# EasyEDA Pro project mt3608.eprj

# Schematic MT3608
Create Date: 2024-01-10; Page Name: P1; Project Name: mt3608; Schematic Name: MT3608; Update Date: 2024-01-10; Company: 嘉立创EDA; Page Size: A4; Version: V1.0
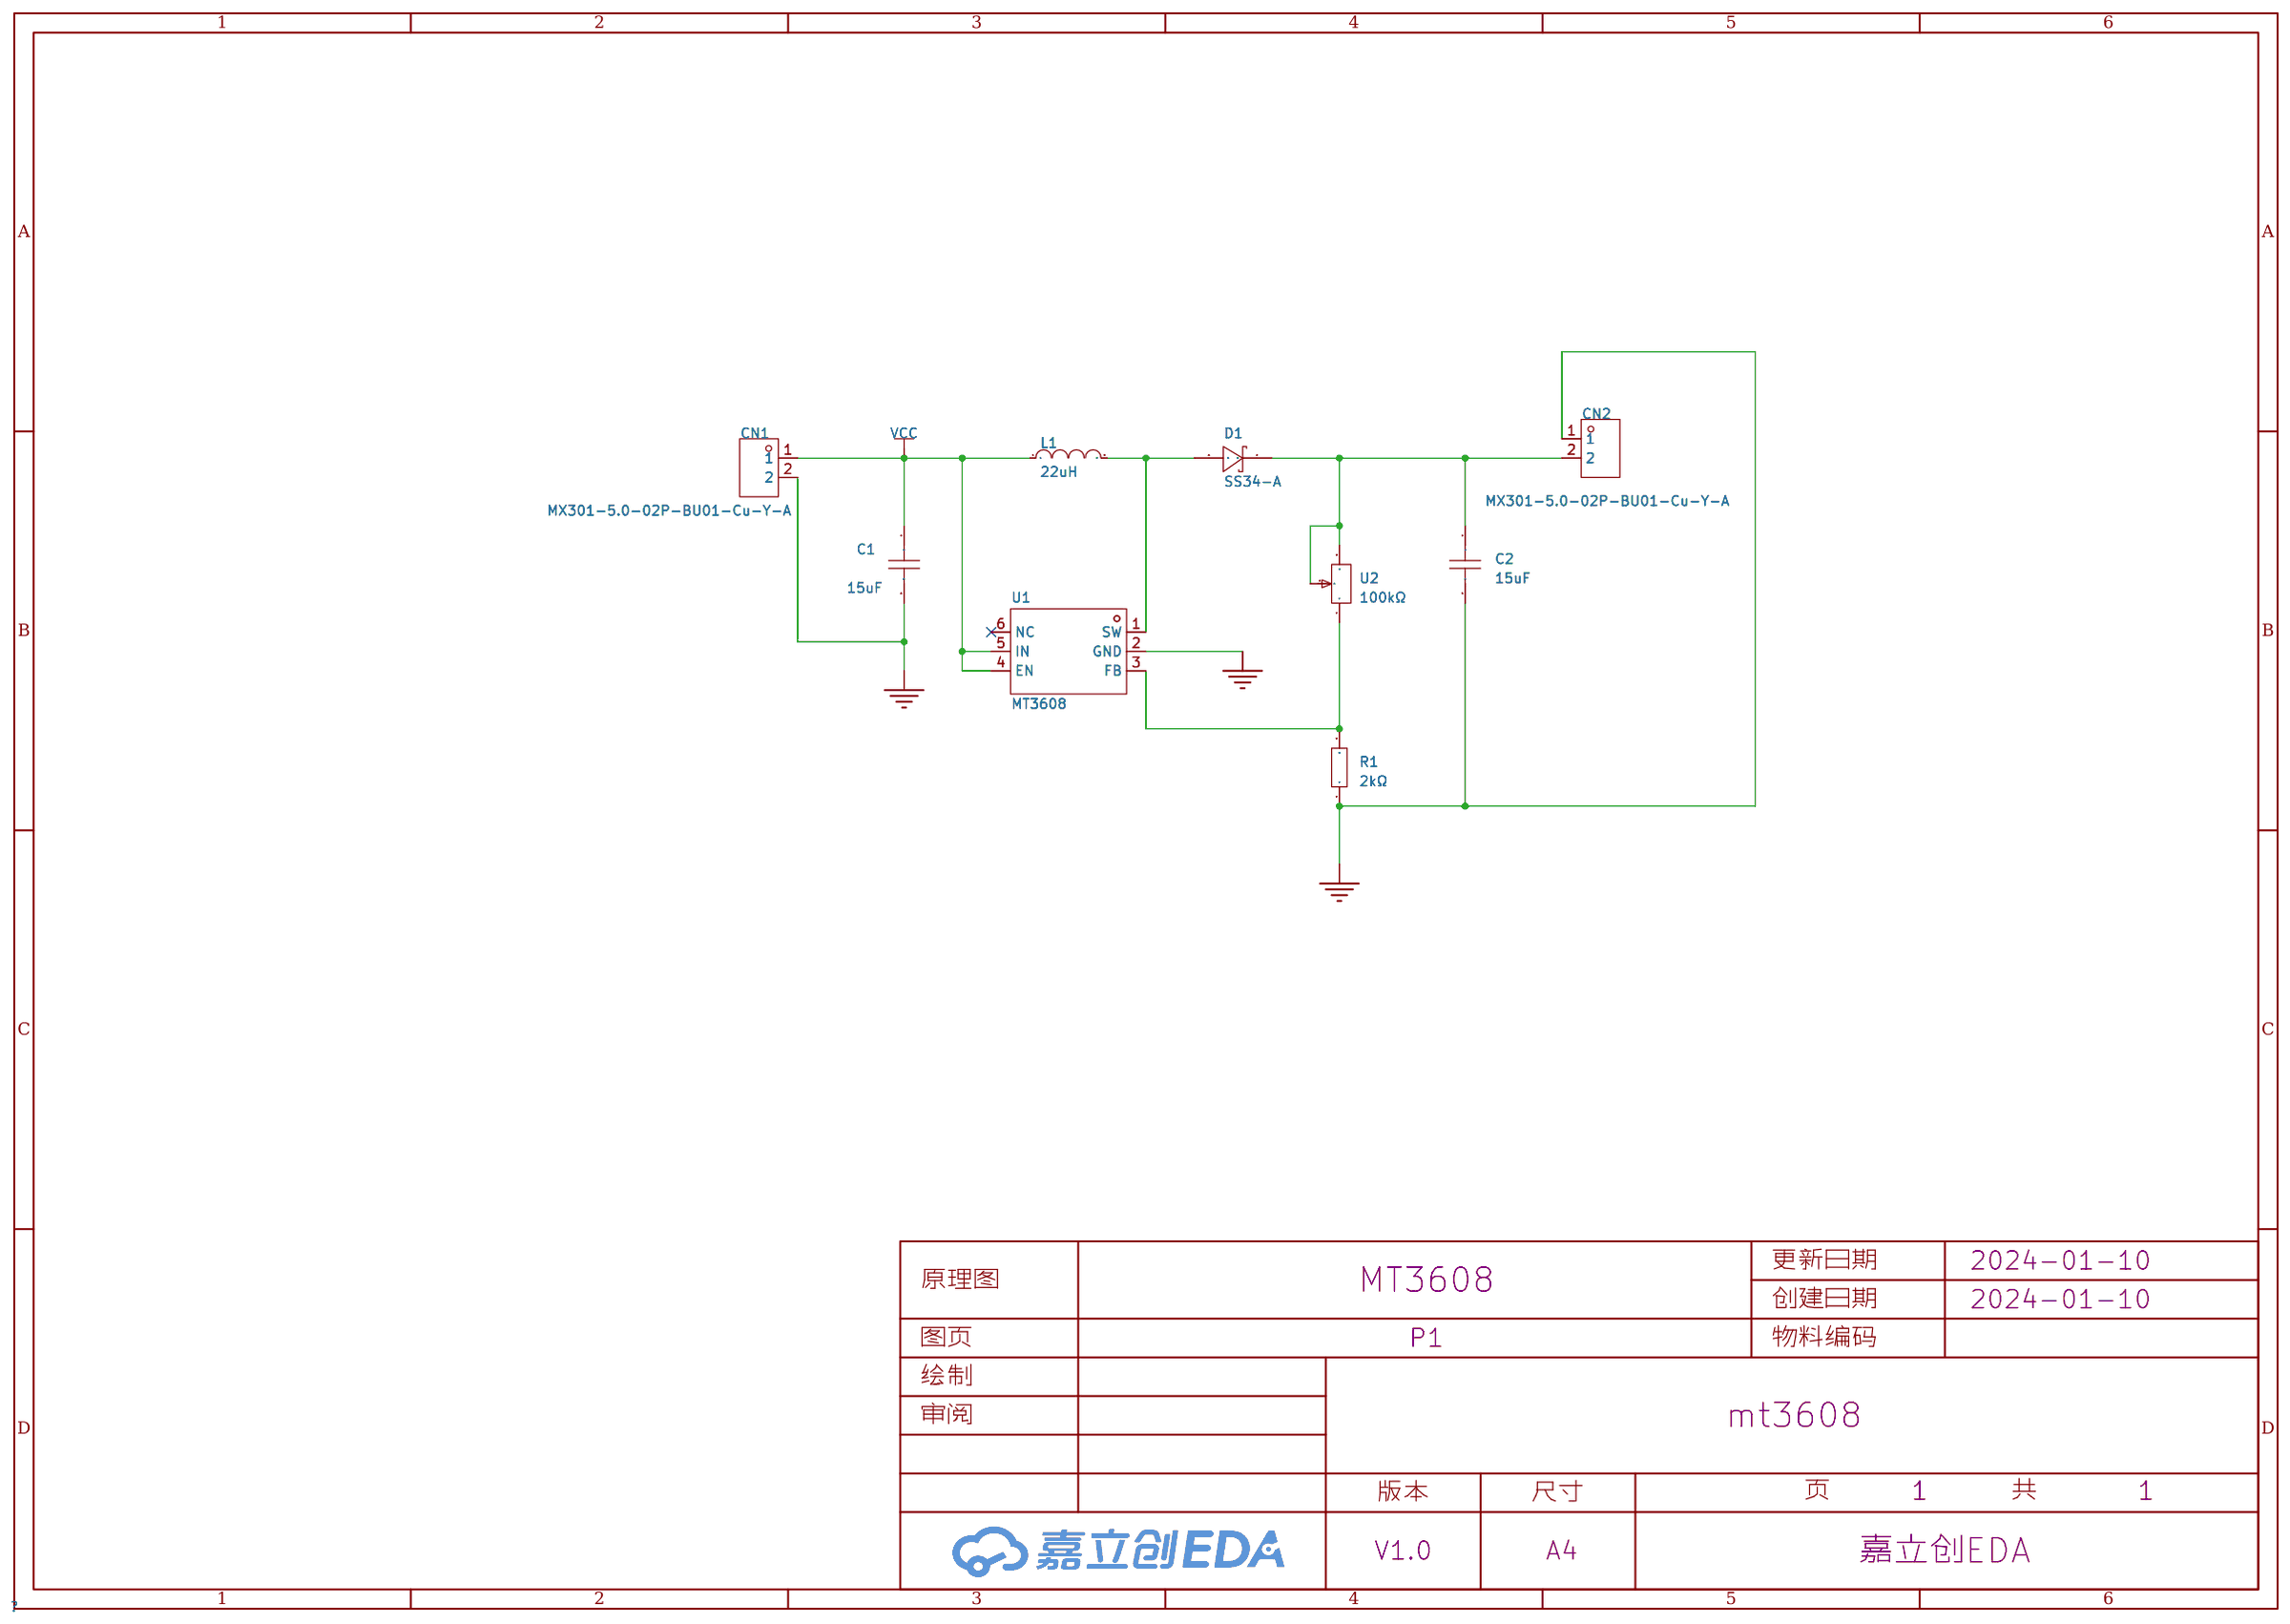
[diagram p0: schematic sheet]

## Parts
C1  15uF  [C0603]
C2  15uF  [C0603]
CN1  MX301-5.0-02P-BU01-Cu-Y-A  [CONN-TH_2P-P5.0-MX301-5.0-02P-BU01-CU-Y-A]
CN2  MX301-5.0-02P-BU01-Cu-Y-A  [CONN-TH_2P-P5.0-MX301-5.0-02P-BU01-CU-Y-A]
D1  SS34-A  [SMA_L4.3-W2.6-LS5.2-RD]
L1  22uH  [IND-SMD_L10.5-W10.5]
R1  2kΩ  [R0603]
U1  MT3608  [SOT-23-6_L2.9-W1.6-P0.95-LS2.8-BL]
U2  100kΩ  [RES-ADJ-SMD_RM065-V1]

## Library data of the parts
C1 C2 = C1608X5R0J156MT000E: 容值:15uF;精度:±20%;额定电压:6.3V;材质(温度系数):X5R;; LCSC Part Name: 15uF ±20% 6.3V; Supplier Part: C445715; Manufacturer: TDK; Supplier Footprint: 0603; JLCPCB Part Class: 扩展库; Datasheet: https://atta.szlcsc.com/upload/public/pdf/source/20191108/C445765_930F403C9F9F1C91FA65B6959DB97EFA.pdf; Supplier: LCSC; Tolerance: ±20%; Voltage Rated: 6.3V; Temperature Coefficient: X5R
CN1 CN2 = MX301-5.0-02P-BU01-Cu-Y-A: 结构:1x2P;间距:5mm;颜色:蓝色;安装方式:直插;额定电流:16A;额定电压:300V;排数:1;线规 - AWG:14~24;线规 - 平方毫米:1.5;每排PIN数:2;触头材质:铜合金;触头镀层:锡;工作温度范围:-40℃~+105℃;; LCSC Part Name: 5mm 1x2P 排数:1 每排P数:2 直插; Supplier Part: C5188422; Manufacturer: MAX(迈旭); Supplier Footprint: 插件,P=5mm; JLCPCB Part Class: Extended Part; Datasheet: https://atta.szlcsc.com/upload/public/pdf/source/20230915/1F0A484E8C4B07E7C9BE20D191F8A304.pdf; Supplier: LCSC; Structure: 1x2P; Pitch: 5mm; Color: 蓝色; Mounting Style: 直插; Current Rating (Max): 16A; Voltage Rating (Max): 300V; Number of Pins: 2P; Number of Rows: 1; Wire Gauge - AWG: 14~24; Wire Gauge - mm2: 1.5; Number of PINs Per Row: 2; Contact Material: 铜合金; Contact Plating: 锡; Operating Temperature Range: -40℃~+105℃
D1 = SS34-A: 正向压降(Vf):550mV@3A;直流反向耐压(Vr):40V;平均整流电流(Io):3A;; LCSC Part Name: 电压:40V 电流:3A; Supplier Part: C143201; Manufacturer: FMS(美丽微); Supplier Footprint: SMA(DO-214AC); JLCPCB Part Class: 扩展库; Datasheet: https://atta.szlcsc.com/upload/public/pdf/source/20171109/C143203_15102201708731103754.pdf; Supplier: LCSC; Forward Voltage (Vf@If): 550mV@3A; Reverse Voltage (Vr): 40V; Average Rectified Current (Io): 3A
L1 = SLD10D40S-220MTT: 电感值:22uH;精度:±20%;额定电流:2.9A;; LCSC Part Name: 22uH ±20%; Supplier Part: C182172; Manufacturer: Sunltech(韩国顺磁); Supplier Footprint: SMD; JLCPCB Part Class: 扩展库; Datasheet: https://atta.szlcsc.com/upload/public/pdf/source/20180516/C216173_9CE92605FA48E61FB30A7708978C0FC3.pdf; Supplier: LCSC; Tolerance: ±20%; Rated Current: 2.9A; DC Resistance (DCR): 73mΩ
R1 = 0603WAF2001T5E: 阻值:2kΩ;精度:±1%;功率:100mW;温度系数:±100ppm/℃;电阻类型:厚膜电阻;; LCSC Part Name: 2kΩ ±1% 100mW 厚膜电阻; Supplier Part: C22975; Manufacturer: UNI-ROYAL(厚声); Supplier Footprint: 0603; JLCPCB Part Class: 基础库; Datasheet: https://atta.szlcsc.com/upload/public/pdf/source/20200306/C422600_1E6D84923E4A46A82E41ADD87F860B5C.pdf; Supplier: LCSC; Tolerance: ±1%; Power(Watts): 100mW; Overload Voltage (Max): 75V; Temperature Coefficient: ±100ppm/℃; Type: 厚膜电阻; Operating Temperature Range: -55℃~+155℃
U1 = MT3608: 功能类型:升压型;输入电压:2V~24V;输出电压:28V;输出电流(最大值):-;; LCSC Part Name: 升压型 输入2V~24V 输出28V; Supplier Part: C84817; Manufacturer: 西安航天民芯; Supplier Footprint: SOT-23-6; JLCPCB Part Class: 扩展库; Datasheet: https://atta.szlcsc.com/upload/public/pdf/source/20161110/1478743351706.pdf; Supplier: LCSC; Function: 升压型; Number of Outputs: 1; Topology: 升压式; Input Voltage: 2V~24V; Output Voltage: 28V; Switching Frequency: 1.2MHz
U2 = RM065-104(100K): 阻值:100kΩ;精度:±25%;功率:100mW;; LCSC Part Name: 100kΩ ±25%; Supplier Part: C5205024; Manufacturer: BOCHEN(博晨); Supplier Footprint: 插件; JLCPCB Part Class: 扩展库; Datasheet: https://atta.szlcsc.com/upload/public/pdf/source/20221019/6263C46FBC7F1B66CBAADA74DC5EFAA2.pdf; Supplier: LCSC; Tolerance: ±25%; Power(Watts): 100mW

## Nets
GND: C1.2 C2.2 CN1.2 CN2.1 R1.1 U1.2(GND)
VCC: C1.1 CN1.1 L1.1 U1.4(EN) U1.5(IN)
$1N519: D1.2(A) L1.2 U1.1(SW)
$1N633: R1.2 U1.3(FB) U2.1
$1N872: C2.1 CN2.2 D1.1(C) U2.2 U2.3

Not connected (* = marked no-connect by the designer): U1 6(NC)*

# Schematic MT3608GUN
Create Date: 2024-01-10; Page Name: P1; Project Name: mt3608; Schematic Name: MT3608GUN; Update Date: 2024-01-10; Company: 嘉立创EDA; Page Size: A4; Version: V1.0
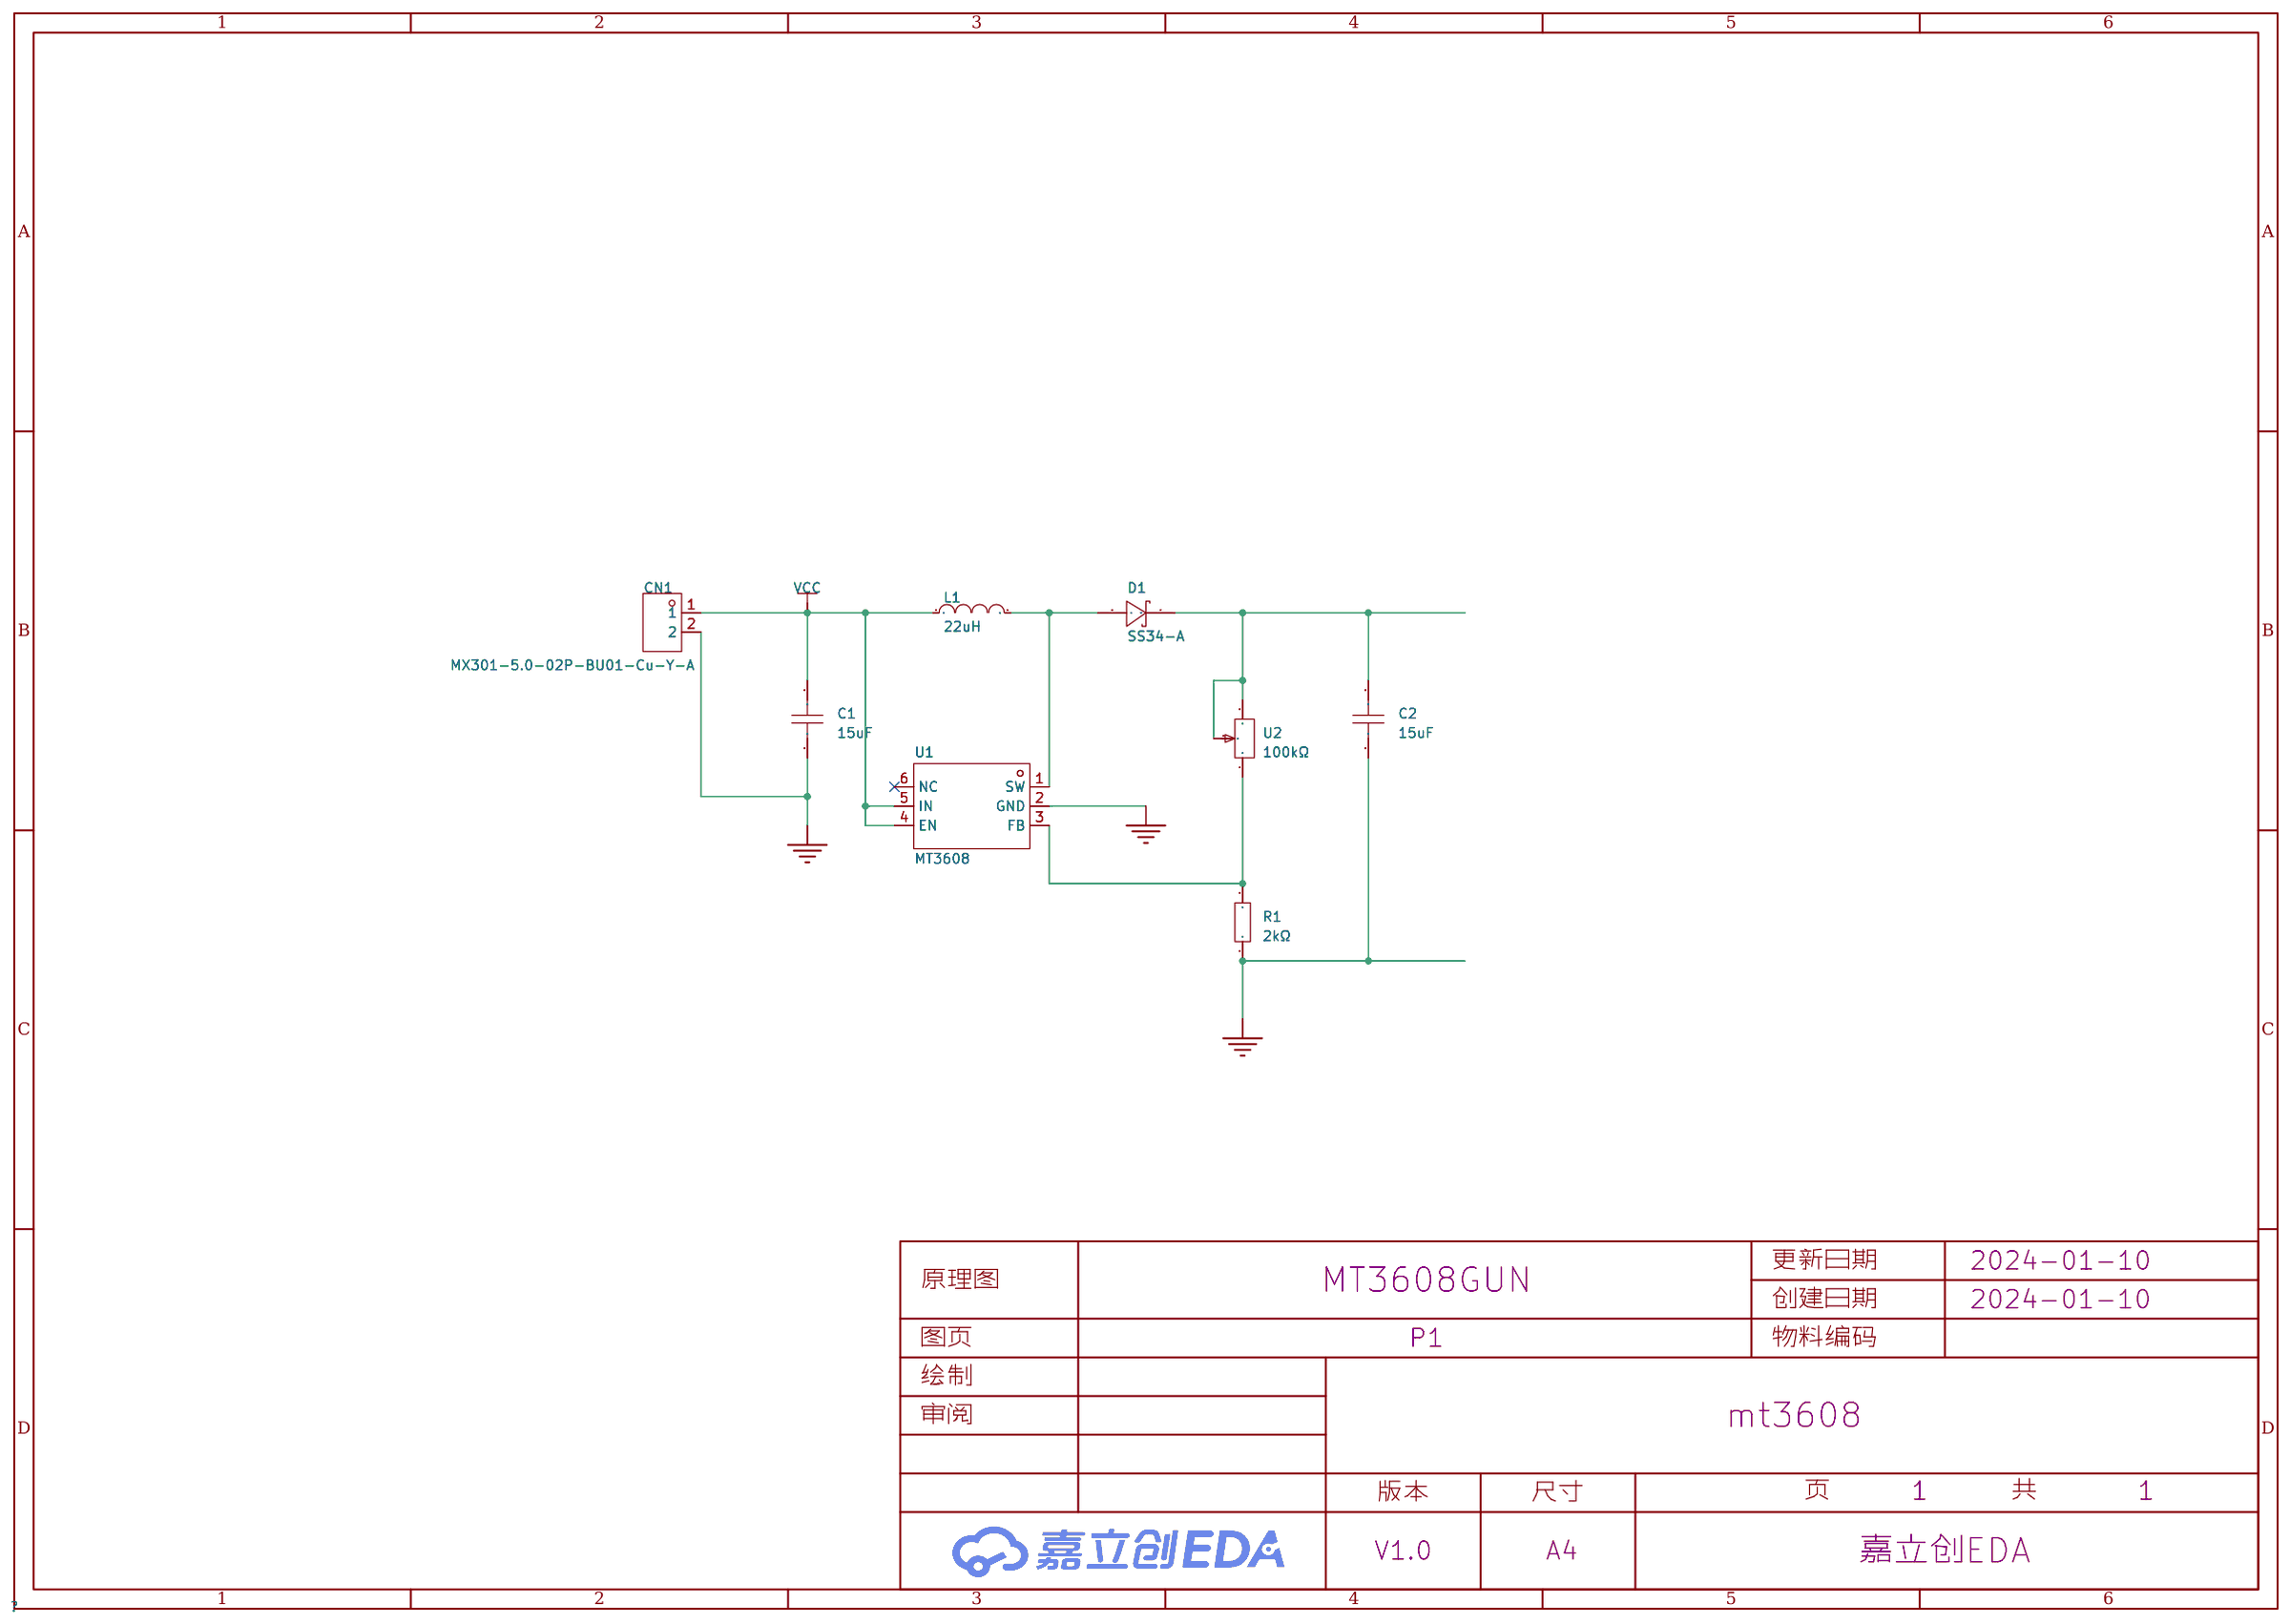
[diagram p1: schematic sheet]

## Parts
C1  15uF  [C0603]
C2  15uF  [C0603]
CN1  MX301-5.0-02P-BU01-Cu-Y-A  [CONN-TH_2P-P5.0-MX301-5.0-02P-BU01-CU-Y-A]
D1  SS34-A  [SMA_L4.3-W2.6-LS5.2-RD]
L1  22uH  [IND-SMD_L10.5-W10.5]
R1  2kΩ  [R0603]
U1  MT3608  [SOT-23-6_L2.9-W1.6-P0.95-LS2.8-BL]
U2  100kΩ  [RES-ADJ-SMD_RM065-V1]

## Library data of the parts
C1 C2 = C1608X5R0J156MT000E: 容值:15uF;精度:±20%;额定电压:6.3V;材质(温度系数):X5R;; LCSC Part Name: 15uF ±20% 6.3V; Supplier Part: C445715; Manufacturer: TDK; Supplier Footprint: 0603; JLCPCB Part Class: 扩展库; Datasheet: https://atta.szlcsc.com/upload/public/pdf/source/20191108/C445765_930F403C9F9F1C91FA65B6959DB97EFA.pdf; Supplier: LCSC; Tolerance: ±20%; Voltage Rated: 6.3V; Temperature Coefficient: X5R
CN1 = MX301-5.0-02P-BU01-Cu-Y-A: 结构:1x2P;间距:5mm;颜色:蓝色;安装方式:直插;额定电流:16A;额定电压:300V;排数:1;线规 - AWG:14~24;线规 - 平方毫米:1.5;每排PIN数:2;触头材质:铜合金;触头镀层:锡;工作温度范围:-40℃~+105℃;; LCSC Part Name: 5mm 1x2P 排数:1 每排P数:2 直插; Supplier Part: C5188422; Manufacturer: MAX(迈旭); Supplier Footprint: 插件,P=5mm; JLCPCB Part Class: Extended Part; Datasheet: https://atta.szlcsc.com/upload/public/pdf/source/20230915/1F0A484E8C4B07E7C9BE20D191F8A304.pdf; Supplier: LCSC; Structure: 1x2P; Pitch: 5mm; Color: 蓝色; Mounting Style: 直插; Current Rating (Max): 16A; Voltage Rating (Max): 300V; Number of Pins: 2P; Number of Rows: 1; Wire Gauge - AWG: 14~24; Wire Gauge - mm2: 1.5; Number of PINs Per Row: 2; Contact Material: 铜合金; Contact Plating: 锡; Operating Temperature Range: -40℃~+105℃
D1 = SS34-A: 正向压降(Vf):550mV@3A;直流反向耐压(Vr):40V;平均整流电流(Io):3A;; LCSC Part Name: 电压:40V 电流:3A; Supplier Part: C143201; Manufacturer: FMS(美丽微); Supplier Footprint: SMA(DO-214AC); JLCPCB Part Class: 扩展库; Datasheet: https://atta.szlcsc.com/upload/public/pdf/source/20171109/C143203_15102201708731103754.pdf; Supplier: LCSC; Forward Voltage (Vf@If): 550mV@3A; Reverse Voltage (Vr): 40V; Average Rectified Current (Io): 3A
L1 = SLD10D40S-220MTT: 电感值:22uH;精度:±20%;额定电流:2.9A;; LCSC Part Name: 22uH ±20%; Supplier Part: C182172; Manufacturer: Sunltech(韩国顺磁); Supplier Footprint: SMD; JLCPCB Part Class: 扩展库; Datasheet: https://atta.szlcsc.com/upload/public/pdf/source/20180516/C216173_9CE92605FA48E61FB30A7708978C0FC3.pdf; Supplier: LCSC; Tolerance: ±20%; Rated Current: 2.9A; DC Resistance (DCR): 73mΩ
R1 = 0603WAF2001T5E: 阻值:2kΩ;精度:±1%;功率:100mW;温度系数:±100ppm/℃;电阻类型:厚膜电阻;; LCSC Part Name: 2kΩ ±1% 100mW 厚膜电阻; Supplier Part: C22975; Manufacturer: UNI-ROYAL(厚声); Supplier Footprint: 0603; JLCPCB Part Class: 基础库; Datasheet: https://atta.szlcsc.com/upload/public/pdf/source/20200306/C422600_1E6D84923E4A46A82E41ADD87F860B5C.pdf; Supplier: LCSC; Tolerance: ±1%; Power(Watts): 100mW; Overload Voltage (Max): 75V; Temperature Coefficient: ±100ppm/℃; Type: 厚膜电阻; Operating Temperature Range: -55℃~+155℃
U1 = MT3608: 功能类型:升压型;输入电压:2V~24V;输出电压:28V;输出电流(最大值):-;; LCSC Part Name: 升压型 输入2V~24V 输出28V; Supplier Part: C84817; Manufacturer: 西安航天民芯; Supplier Footprint: SOT-23-6; JLCPCB Part Class: 扩展库; Datasheet: https://atta.szlcsc.com/upload/public/pdf/source/20161110/1478743351706.pdf; Supplier: LCSC; Function: 升压型; Number of Outputs: 1; Topology: 升压式; Input Voltage: 2V~24V; Output Voltage: 28V; Switching Frequency: 1.2MHz
U2 = RM065-104(100K): 阻值:100kΩ;精度:±25%;功率:100mW;; LCSC Part Name: 100kΩ ±25%; Supplier Part: C5205024; Manufacturer: BOCHEN(博晨); Supplier Footprint: 插件; JLCPCB Part Class: 扩展库; Datasheet: https://atta.szlcsc.com/upload/public/pdf/source/20221019/6263C46FBC7F1B66CBAADA74DC5EFAA2.pdf; Supplier: LCSC; Tolerance: ±25%; Power(Watts): 100mW

## Nets
GND: C1.2 C2.2 CN1.2 R1.1 U1.2(GND)
VCC: C1.1 CN1.1 L1.1 U1.4(EN) U1.5(IN)
$1N430: D1.2(A) L1.2 U1.1(SW)
$1N432: R1.2 U1.3(FB) U2.1
$1N433: C2.1 D1.1(C) U2.2 U2.3

Not connected (* = marked no-connect by the designer): U1 6(NC)*

# Schematic MT3608V2
Create Date: 2024-05-22; Page Name: P1; Project Name: mt3608; Schematic Name: MT3608V2; Update Date: 2024-05-23; Company: 嘉立创EDA; Page Size: A4; Version: V1.0
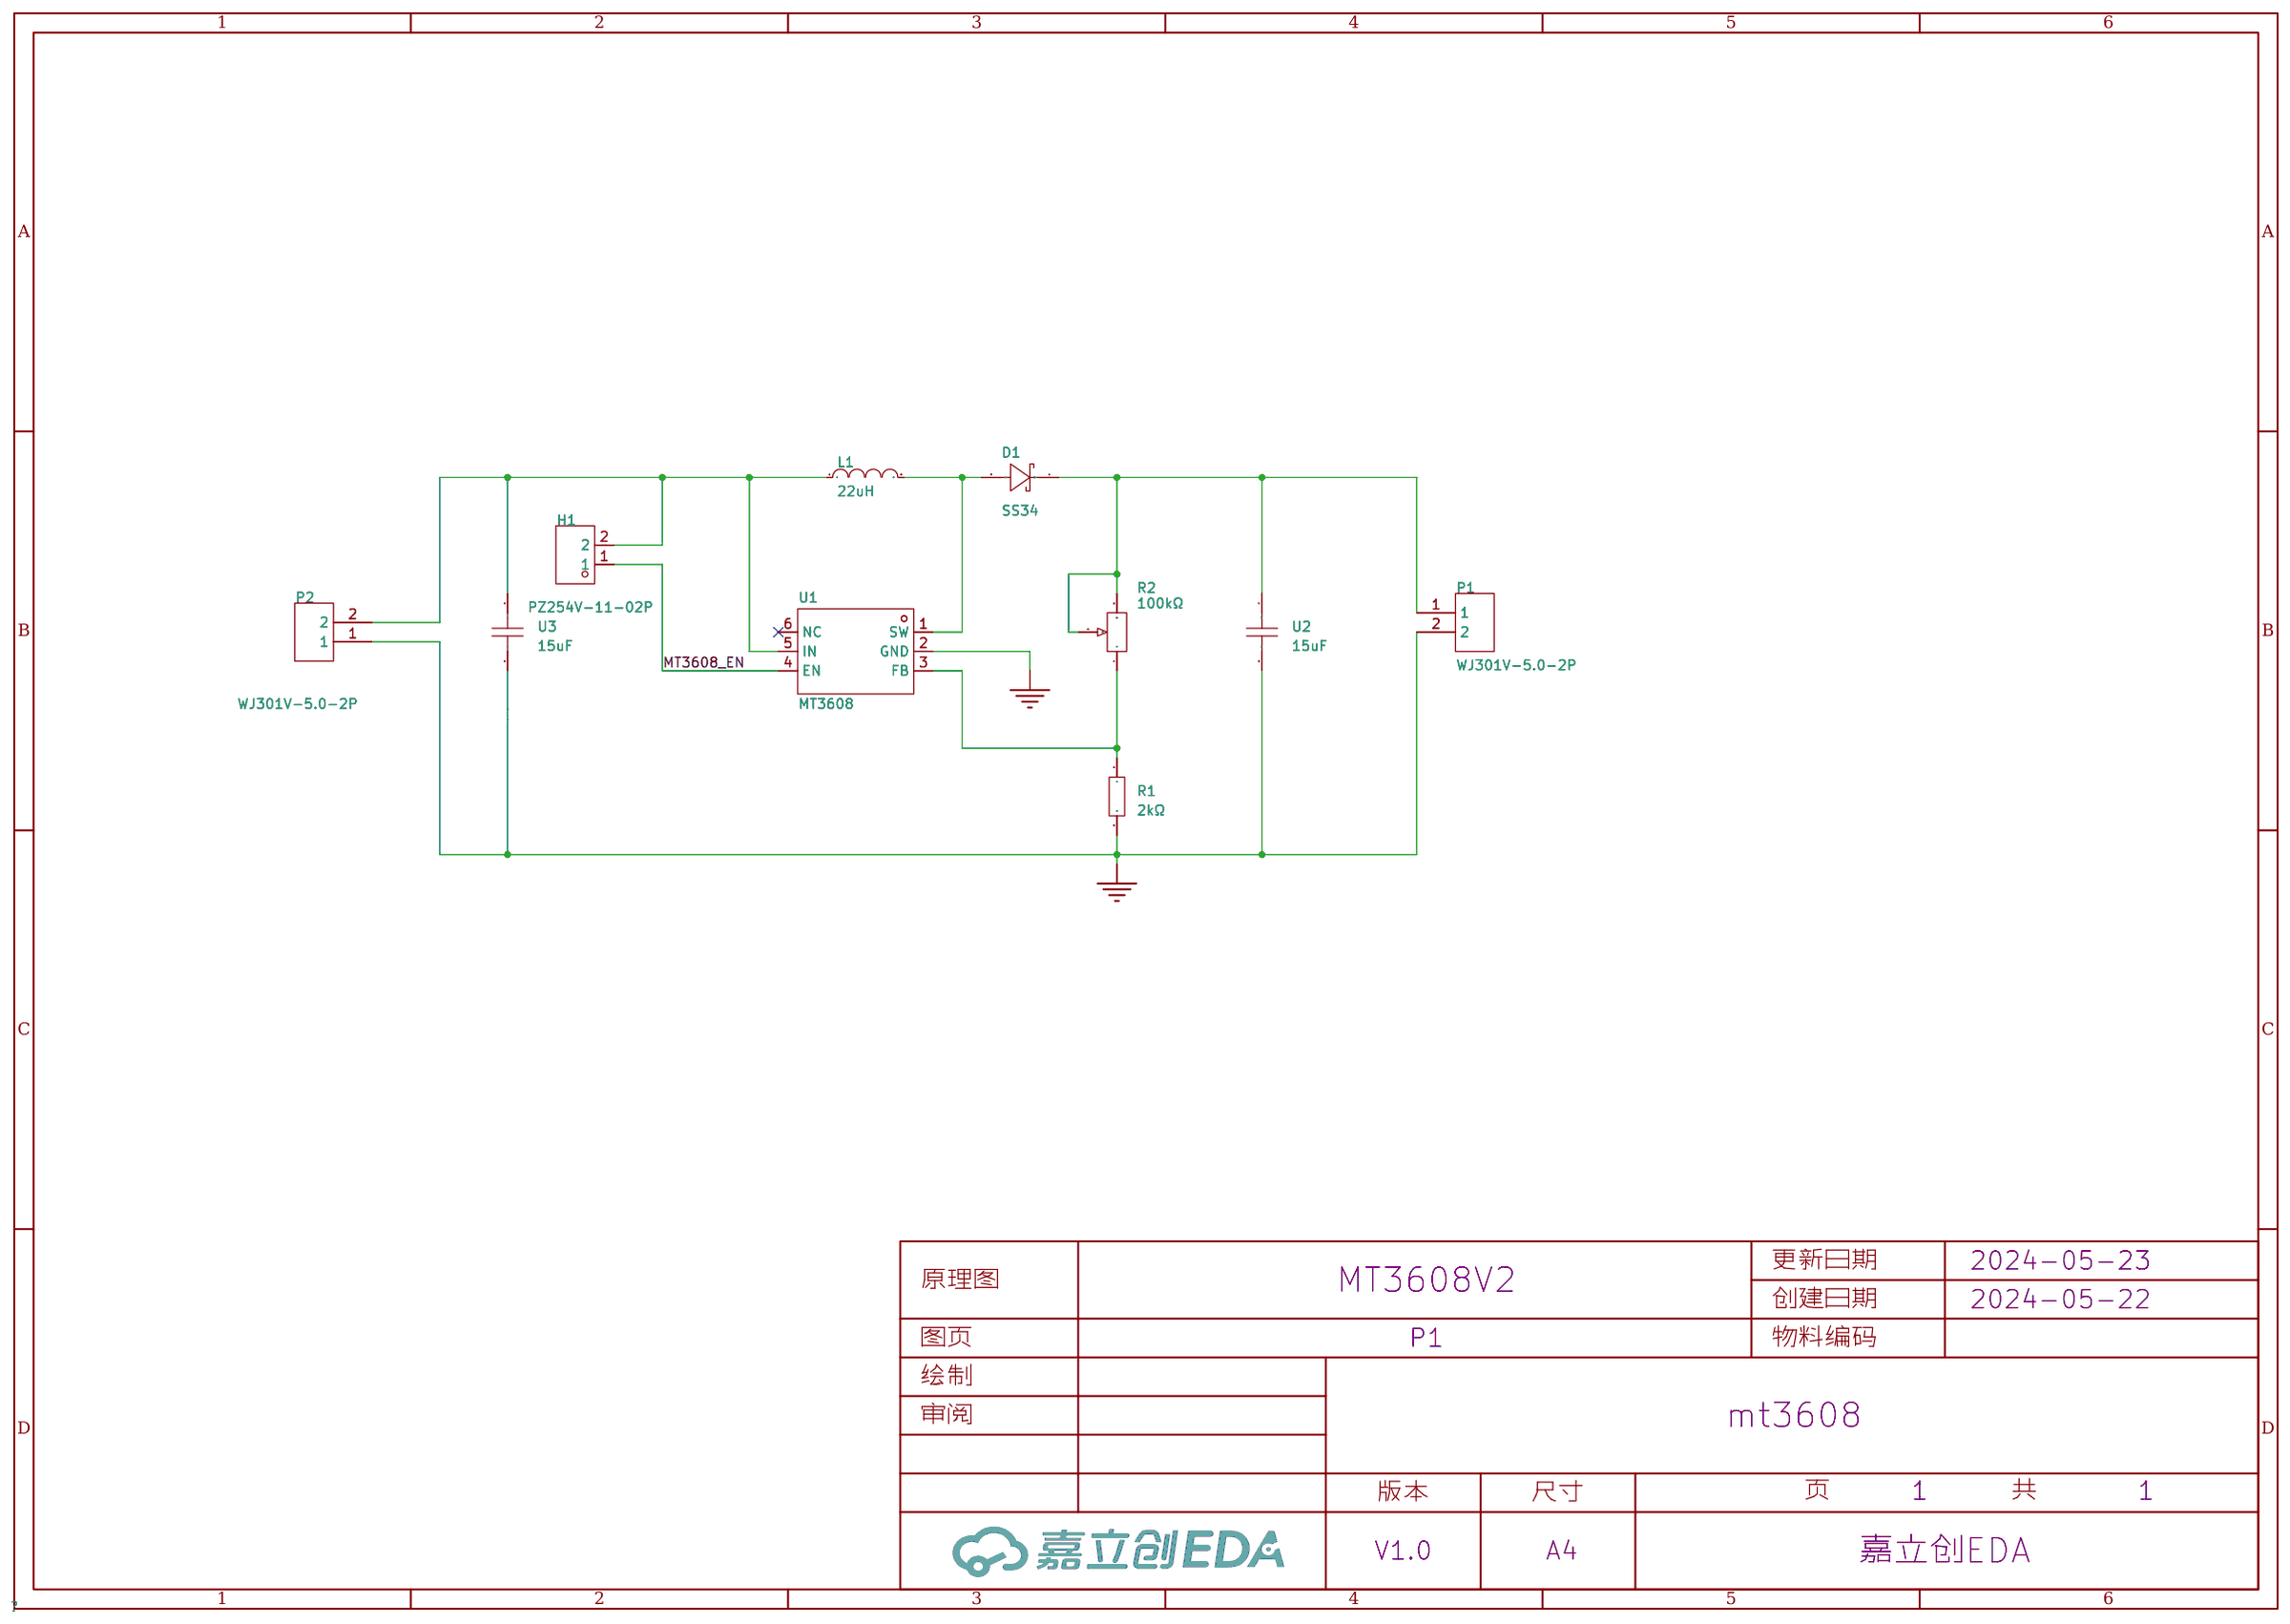
[diagram p2: schematic sheet]

## Parts
D1  SS34  [SMA_L4.3-W2.5-LS5.0-RD]
H1  PZ254V-11-02P  [HDR-TH_2P-P2.54-V-M]
L1  22uH  [IND-SMD_L7.1-W6.6]
P1  WJ301V-5.0-2P  [CONN-TH_2P-P5.00_WJ301V-5.00-2P]
P2  WJ301V-5.0-2P  [CONN-TH_2P-P5.00_WJ301V-5.00-2P]
R1  2kΩ  [R0603]
R2  100kΩ  [RES-ADJ-TH_3P-L9.5-W4.9-P2.50-L_3296W]
U1  MT3608  [SOT-23-6_L2.9-W1.6-P0.95-LS2.8-BL]
U2  15uF  [C1206]
U3  15uF  [C1206]

## Library data of the parts
D1 = SS34_C727060: 二极管配置:独立式;正向压降(Vf):550mV@3A;直流反向耐压(Vr):40V;平均整流电流(Io):3A;; LCSC Part Name: 电压:40V 电流:3A; Supplier Part: C727060; Manufacturer: TWGMC(台湾迪嘉); Supplier Footprint: SMA(DO-214AC); JLCPCB Part Class: 扩展库; Datasheet: https://atta.szlcsc.com/upload/public/pdf/source/20200828/C727059_6599B6CAC5F3238B9C33E46794659DBE.pdf; Supplier: LCSC; Diode Configuration: 独立式; Forward Voltage (Vf@If): 550mV@3A; Reverse Voltage (Vr): 40V; Average Rectified Current (Io): 3A; Reverse Leakage Current (Ir): 500uA@40V
H1 = PZ254V-11-02P: 插针结构:1x2P;间距:2.54mm;行距:-;圆针/方针:方针;安装类型:直插;排数:单排;总PIN位数:2P;额定电流:-;额定电压:-;配合针长度:6mm;塑高:2.5mm;端接针长度:3mm;触头材质:黄铜;触头镀层:-;工作温度范围:-40℃~+105℃;颜色:黑色;; LCSC Part Name: 间距:2.54mm 1x2P 直插 方针; Supplier Part: C492401; Manufacturer: XFCN(兴飞); Supplier Footprint: 插件,P=2.54mm; JLCPCB Part Class: 扩展库; Datasheet: https://atta.szlcsc.com/upload/public/pdf/source/20200309/C492401_A812433581A9B211A7FFA413ADDFF0E5.pdf; Supplier: LCSC; Pin Structure: 1x2P; Pitch: 2.54mm; Circluar Pins/Square Pins: 方针; Mounting Type: 直插; Number of Rows: 单排; Number of Pins: 2P; Length of Mating Pin: 6mm; Insulation Height: 2.5mm; Length of End Connection Pin: 3mm; Contact Material: 黄铜; Operating Temperature Range: -40℃~+105℃; Color: 黑色
L1 = YSPI0630A-220M: 电感值:22uH;精度:±20%;额定电流:3A;; LCSC Part Name: 22uH ±20%; Supplier Part: C497873; Manufacturer: YJYCOIN(益嘉源); Supplier Footprint: SMD,6.6x7.1mm; JLCPCB Part Class: 扩展库; Datasheet: https://atta.szlcsc.com/upload/public/pdf/source/20200317/C497869_D09F597887D5FB8B541C5C98B400E286.pdf; Supplier: LCSC; Tolerance: ±20%; Rated Current: 3A; DC Resistance (DCR): 130mΩ
P1 P2 = WJ301V-5.0-2P: 结构:1x2P;间距:5mm;颜色:蓝色;安装方式:直插;额定电流:17.5A;额定电压:250V;排数:1;线规 - AWG:14~22;线规 - 平方毫米:1.5;每排PIN数:2;工作温度范围:-30℃~+120℃;; LCSC Part Name: 5mm 1x2P 排数:1 每排P数:2 直插; Supplier Part: C8475; Manufacturer: KANGNEX(康奈克斯电气); Supplier Footprint: 插件,P=5mm; JLCPCB Part Class: 扩展库; Datasheet: https://atta.szlcsc.com/upload/public/pdf/source/20191225/C8475_44061C6AEE590DF3BFA2B6A28FAAB4F6.pdf; Supplier: LCSC; Structure: 1x2P; Pitch: 5mm; Color: 蓝色; Mounting Style: 直插; Current Rating (Max): 17.5A; Voltage Rating (Max): 250V; Number of Pins: 2P; Number of Rows: 1; Wire Gauge - AWG: 14~22; Wire Gauge - mm2: 1.5; Number of PINs Per Row: 2; Operating Temperature Range: -30℃~+120℃
R1 = 0603WAF2001T5E: 阻值:2kΩ;精度:±1%;功率:100mW;温度系数:±100ppm/℃;电阻类型:厚膜电阻;; LCSC Part Name: 2kΩ ±1% 100mW 厚膜电阻; Supplier Part: C22975; Manufacturer: UNI-ROYAL(厚声); Supplier Footprint: 0603; JLCPCB Part Class: 基础库; Datasheet: https://atta.szlcsc.com/upload/public/pdf/source/20200306/C422600_1E6D84923E4A46A82E41ADD87F860B5C.pdf; Supplier: LCSC; Tolerance: ±1%; Power(Watts): 100mW; Overload Voltage (Max): 75V; Temperature Coefficient: ±100ppm/℃; Type: 厚膜电阻; Operating Temperature Range: -55℃~+155℃
R2 = 3296W-1-104: 阻值:100kΩ;精度:±10%;; LCSC Part Name: 100kΩ ±10%; Supplier Part: C118963; Manufacturer: BOCHEN(博晨); Supplier Footprint: 插件; JLCPCB Part Class: 扩展库; Datasheet: https://atta.szlcsc.com/upload/public/pdf/source/20171114/C118963_15106326662041117450.pdf; Supplier: LCSC; Tolerance: ±10%
U1 = MT3608: 功能类型:升压型;输入电压:2V~24V;输出电压:28V;输出电流(最大值):-;; LCSC Part Name: 升压型 输入2V~24V 输出28V; Supplier Part: C84817; Manufacturer: 西安航天民芯; Supplier Footprint: SOT-23-6; JLCPCB Part Class: 扩展库; Datasheet: https://atta.szlcsc.com/upload/public/pdf/source/20161110/1478743351706.pdf; Supplier: LCSC; Function: 升压型; Number of Outputs: 1; Topology: 升压式; Input Voltage: 2V~24V; Output Voltage: 28V; Switching Frequency: 1.2MHz
U2 U3 = C3216X5R1V156M160AC: 容值:15uF;精度:±20%;额定电压:35V;材质(温度系数):X5R;; LCSC Part Name: 15uF ±20% 35V; Supplier Part: C2179320; Manufacturer: TDK; Supplier Footprint: 1206; JLCPCB Part Class: 扩展库; Datasheet: https://atta.szlcsc.com/upload/public/pdf/source/20210430/12912E3792F621391F28022904E5A4A4.pdf; Supplier: LCSC; Tolerance: ±20%; Voltage Rated: 35V; Temperature Coefficient: X5R

## Nets
GND: P1.2 P2.1 R1.2 U1.2(GND) U2.2 U3.2
MT3608_EN: H1.1 U1.4(EN)
$1N291: D1.2(A) L1.2 U1.1(SW)
$1N489: R1.1 R2.1 U1.3(FB)
$1N803: D1.1(C) P1.1 R2.2 R2.3 U2.1
$1N1010: H1.2 L1.1 P2.2 U1.5(IN) U3.1

Not connected (* = marked no-connect by the designer): U1 6(NC)*

# Board MT3608
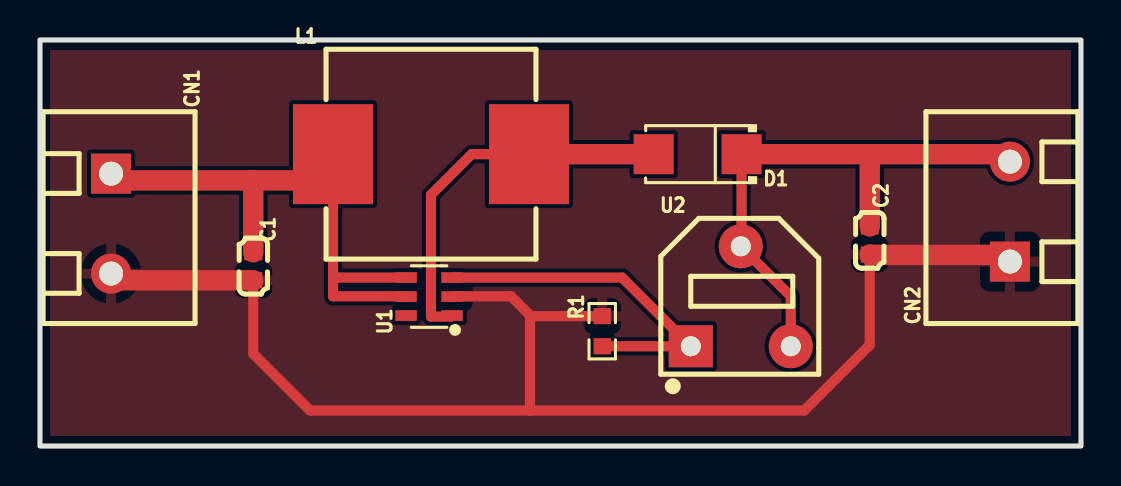
[diagram p3: board, top side]
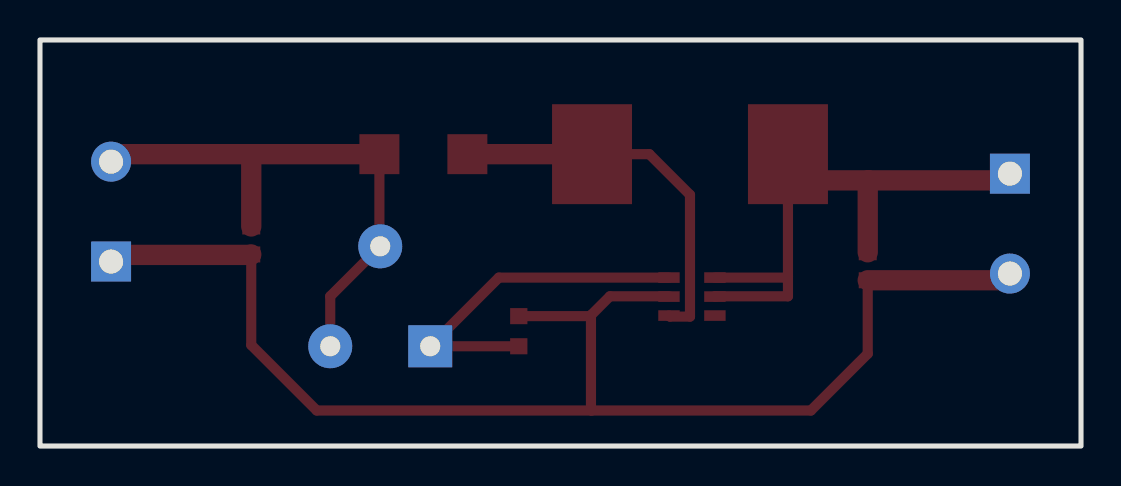
[diagram p4: board, bottom side, seen from below]

Outline 52.07 x 20.32 mm; copper layers: Top Layer, Bottom Layer. Coordinates in mm from the lower left corner of the outline.
Outline path: rectangle 0,20.32 52.07,0
Stack: Top Layer 0.035mm / Dielectric1 1.51mm FR4 er 4.5 / Bottom Layer 0.035mm

## Design rules (mm)
template: JLCPCB Capability(Two Layers Board)
spacing copperThickness1oz (default): track to track 0.102, other pairs 0.152 to 0.3
spacing copperThickness2oz: track to track 0.203, other pairs 0.152 to 0.3
track width copperThickness1oz (default): min 0.127, default 0.254, max 2.54
track width copperThickness2oz: min 0.203, default 0.254, max 2.54
differential pair differentialPair (default): width min 0.127, default 0.254, max 2.54; gap min 0.152, default 0.152
via viaSize (default): diameter min 0.5, default 0.61, max 10; hole min 0.3, default 0.305, max 6.3

## Placement (name value [footprint] x y rotation side)
C1  15uF  [C0603]  10.67 8.99 270 top
C2  15uF  [C0603]  41.5 10.29 270 top
CN1  MX301-5.0-02P-BU01-Cu-Y-A  [CONN-TH_2P-P5.0-MX301-5.0-02P-BU01-CU-Y-A]  3.56 11.13 270 top
CN2  MX301-5.0-02P-BU01-Cu-Y-A  [CONN-TH_2P-P5.0-MX301-5.0-02P-BU01-CU-Y-A]  48.51 11.73 90 top
D1  SS34-A  [SMA_L4.3-W2.6-LS5.2-RD]  32.89 14.6 180 top
L1  22uH  [IND-SMD_L10.5-W10.5]  19.56 14.6 0 top
R1  2kΩ  [R0603]  28.12 5.75 270 top
U1  MT3608  [SOT-23-6_L2.9-W1.6-P0.95-LS2.8-BL]  19.46 7.48 90 top
U2  100kΩ  [RES-ADJ-SMD_RM065-V1]  35.05 7.49 0 top

## Footprints (pads in the part's own frame, mm; a bottom-side part is the same pattern mirrored in y, then rotated)
C0603
  rect 0.8x0.9 smd: 1(-0.7,0) 2(0.7,0)
CONN-TH_2P-P5.0-MX301-5.0-02P-BU01-CU-Y-A
  rect 2x2 hole 1.2: 1(-2.5,0)
  round 2 hole 1.2: 2(2.5,0)
IND-SMD_L10.5-W10.5
  rect 4x5 smd: 1(-4.9,0) 2(4.9,0)
R0603
  rect 0.806x0.864 smd: 1(-0.753,0) 2(0.753,0)
RES-ADJ-SMD_RM065-V1
  rect 2.2x2.1 hole 1: 1(-2.5,-2.5)
  round 2.2 hole 1: 2(0,2.5) 3(2.5,-2.5)
SMA_L4.3-W2.6-LS5.2-RD
  rect 2x2 smd: 1(-2.2,0) 2(2.2,0)
SOT-23-6_L2.9-W1.6-P0.95-LS2.8-BL
  rect 0.532x1.072 smd: 1(-0.95,-1.149) 2(0,-1.149) 3(0.95,-1.149) 4(0.95,1.149) 5(0,1.149) 6(-0.95,1.149)

## Nets
As in the schematic.

Pads without a net: U1 6

## Routing (per net, layer and track width the routed paths; a pad name or vN(x,y) marks a point on that pad's centre or on a via; arc(x,y) is an arc through that point)
GND: length 68.4
  Top Layer w0.508: 20.61,7.49 23.56,7.49 24.51,6.54 ; 24.49,1.78 38.23,1.78 41.5,5.05 C2.2 ; 24.49,1.78 24.51,1.8 24.51,6.54 ; 24.49,1.78 13.51,1.78 10.67,4.62 C1.2 ; 24.51,6.54 24.56,6.5 R1.1
  Top Layer w1.016: 3.56,8.29 C1.2 ; C2.2 41.53,9.56 48.51,9.56
VCC: length 29.7
  Top Layer w0.254: 13.35,13.29 L1.1
  Top Layer w0.508: U1.5 18.3,7.49 14.66,7.49 14.66,8.47 ; 14.66,8.47 14.7,8.43 18.31,8.43 ; 14.66,8.47 L1.1
  Top Layer w1.016: 10.63,13.29 10.67,13.26 C1.1 ; 10.63,13.29 13.35,13.29 ; 10.63,13.29 3.56,13.29
$1N519: length 19.1
  Top Layer w0.508: U1.1 20.56,6.48 19.56,6.48 19.56,12.57 21.59,14.6 L1.2
  Top Layer w1.016: L1.2 D1.2
$1N633: length 17.8
  Top Layer w0.508: R1.2 U2.1 29.12,8.43 20.61,8.43
$1N872: length 27.7
  Top Layer w0.508: D1.1 35.09,10.03 U2.2 37.55,7.49 U2.3
  Top Layer w1.016: 41.6,14.6 41.5,14.5 C2.1 ; 41.6,14.6 48.47,14.6 ; 41.6,14.6 D1.1

## Copper pours and planes (outline as drawn; the poured copper is in the pictures)
GND on Top Layer: 0,20.32 52.07,20.32 52.07,0 0,0

# Board MT3608GUN
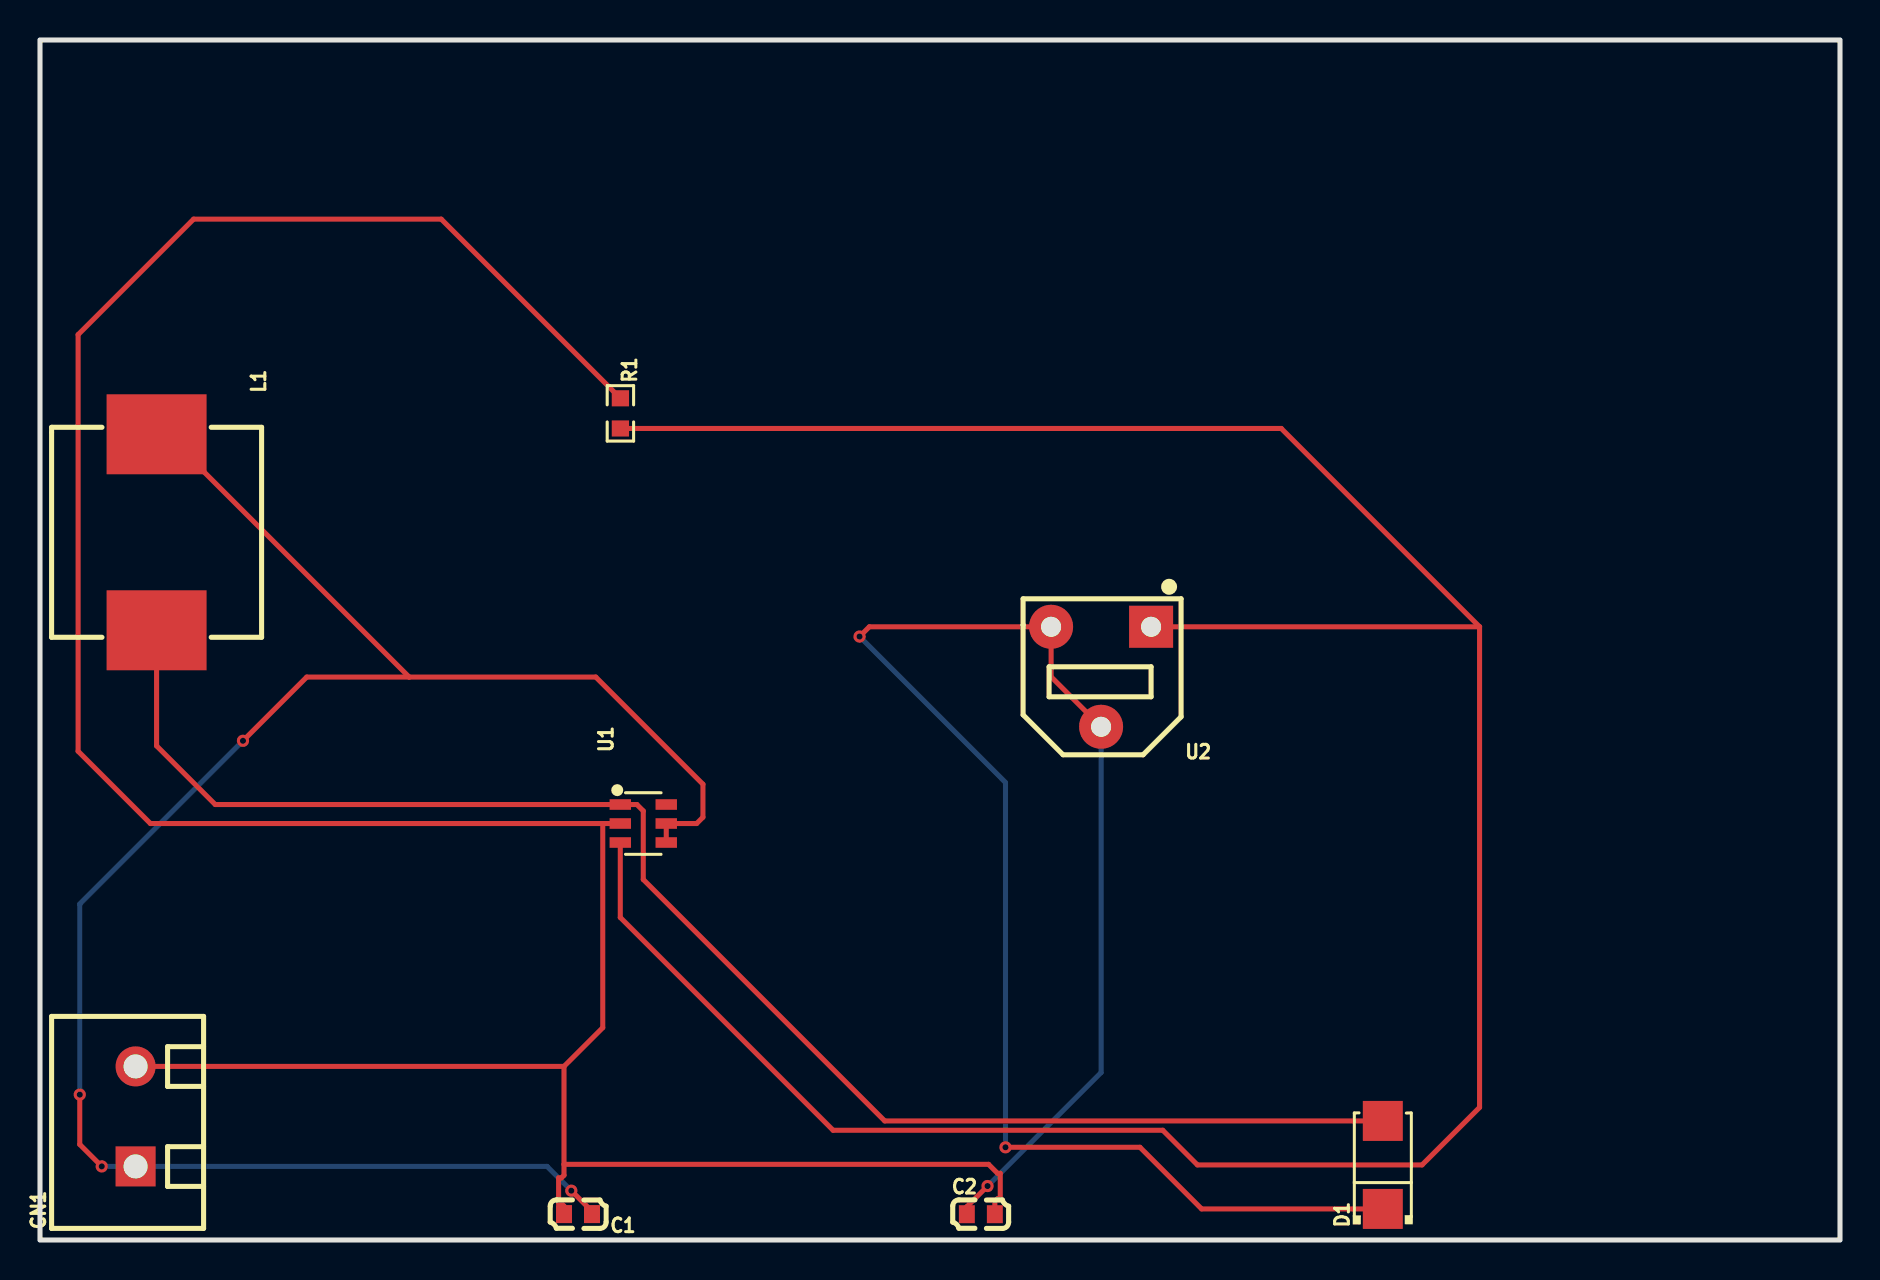
[diagram p5: board, top side]
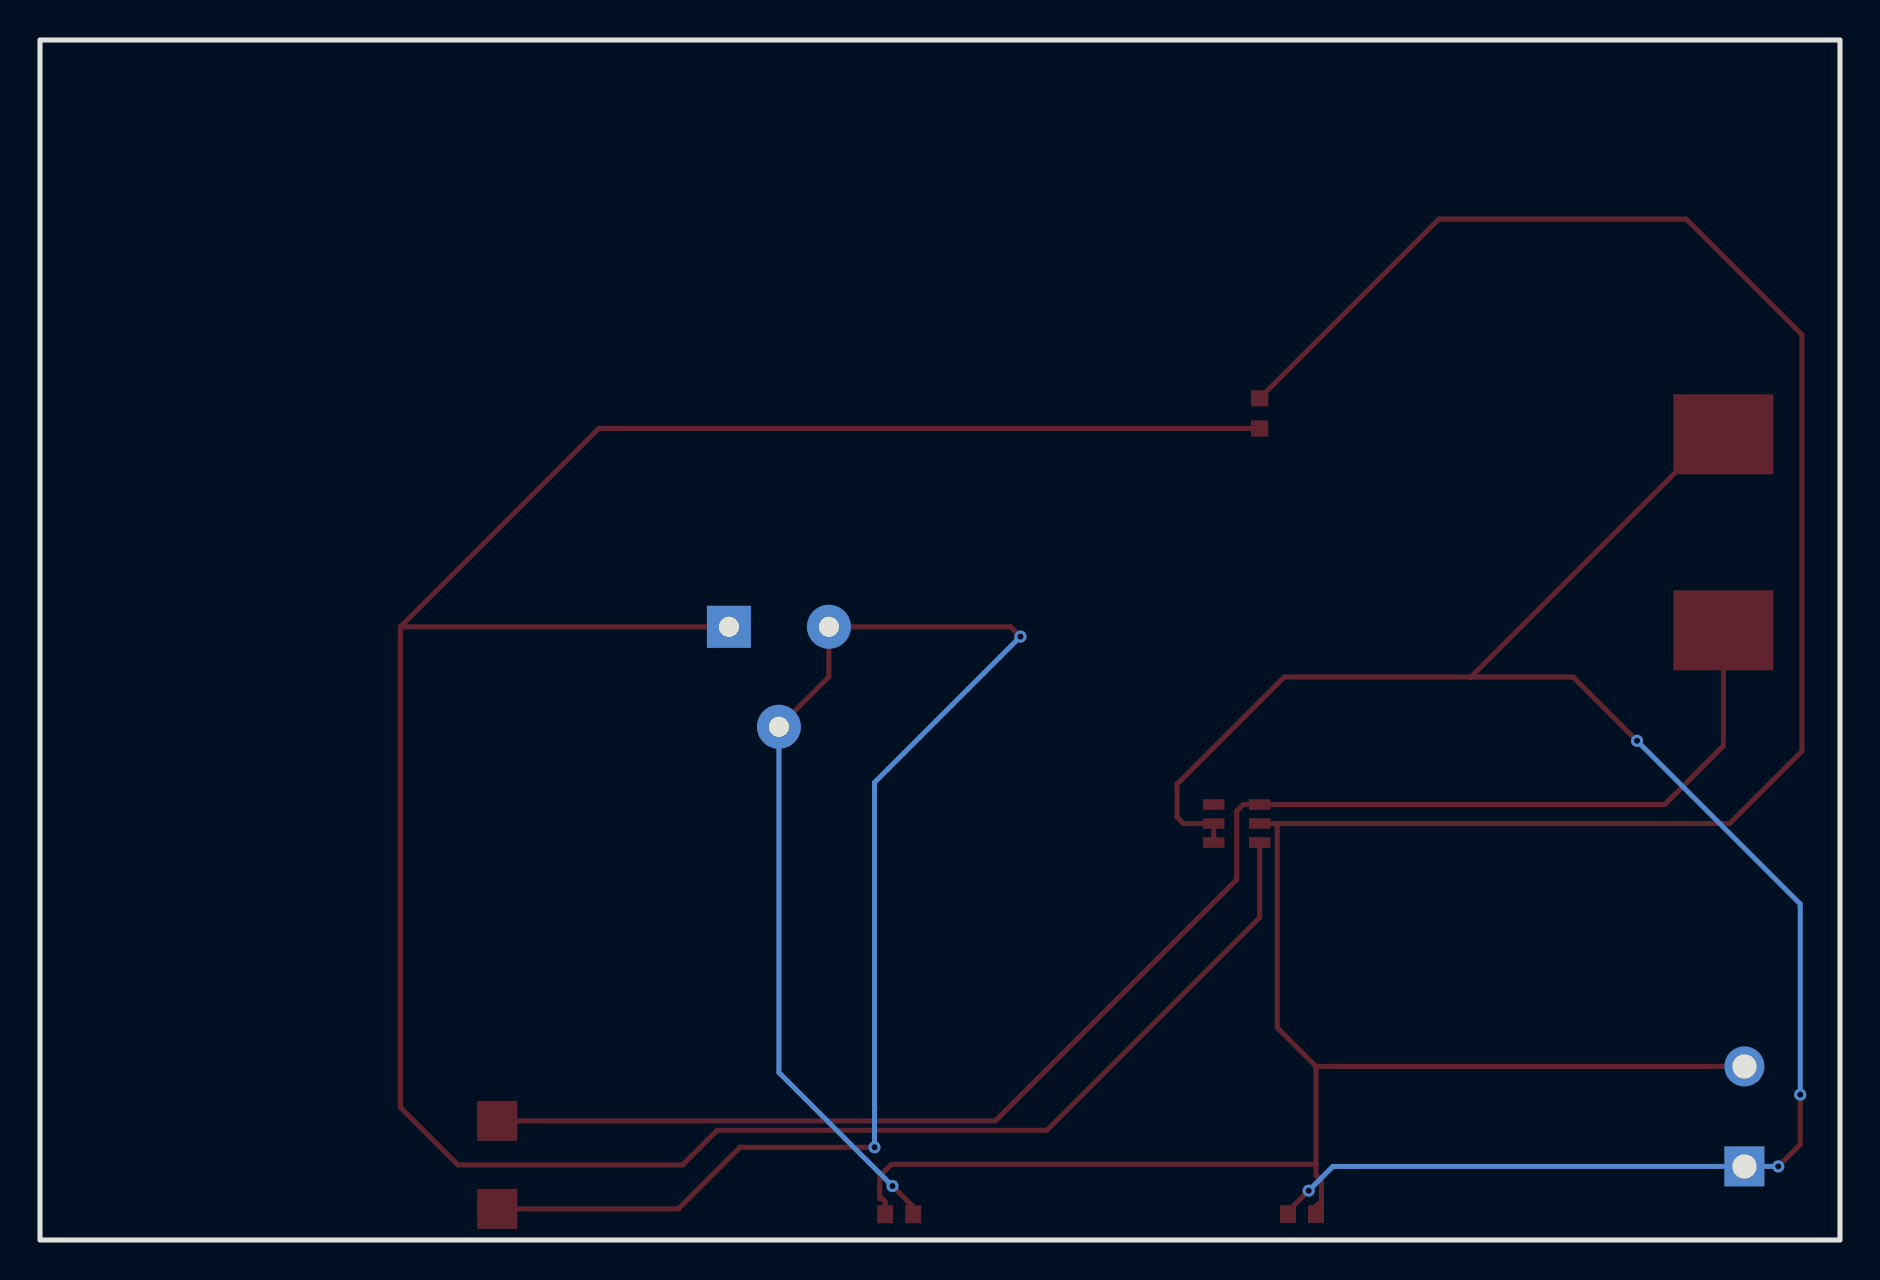
[diagram p6: board, bottom side, seen from below]

Outline 90 x 60 mm; copper layers: Top Layer, Bottom Layer. Coordinates in mm from the lower left corner of the outline.
Outline path: rectangle 0,60 90,0
Stack: Top Layer 0.035mm / Dielectric1 1.51mm FR4 er 4.5 / Bottom Layer 0.035mm

## Design rules (mm)
template: JLCPCB Capability(Two Layers Board)
spacing copperThickness1oz (default): track to track 0.102, other pairs 0.152 to 0.3
spacing copperThickness2oz: track to track 0.203, other pairs 0.152 to 0.3
track width copperThickness1oz (default): min 0.127, default 0.254, max 2.54
track width copperThickness2oz: min 0.203, default 0.254, max 2.54
differential pair differentialPair (default): width min 0.127, default 0.254, max 2.54; gap min 0.152, default 0.152
via viaSize (default): diameter min 0.5, default 0.61, max 10; hole min 0.3, default 0.305, max 6.3

## Placement (name value [footprint] x y rotation side)
C1  15uF  [C0603]  26.9 1.29 180 top
C2  15uF  [C0603]  47.04 1.29 0 top
CN1  MX301-5.0-02P-BU01-Cu-Y-A  [CONN-TH_2P-P5.0-MX301-5.0-02P-BU01-CU-Y-A]  4.78 6.18 90 top
D1  SS34-A  [SMA_L4.3-W2.6-LS5.2-RD]  67.14 3.75 90 top
L1  22uH  [IND-SMD_L10.5-W10.5]  5.83 35.39 270 top
R1  2kΩ  [R0603]  29.02 41.33 270 top
U1  MT3608  [SOT-23-6_L2.9-W1.6-P0.95-LS2.8-BL]  30.16 20.82 270 top
U2  100kΩ  [RES-ADJ-SMD_RM065-V1]  53.06 28.16 180 top

## Footprints (pads in the part's own frame, mm; a bottom-side part is the same pattern mirrored in y, then rotated)
C0603
  rect 0.8x0.9 smd: 1(-0.7,0) 2(0.7,0)
CONN-TH_2P-P5.0-MX301-5.0-02P-BU01-CU-Y-A
  rect 2x2 hole 1.2: 1(-2.5,0)
  round 2 hole 1.2: 2(2.5,0)
IND-SMD_L10.5-W10.5
  rect 4x5 smd: 1(-4.9,0) 2(4.9,0)
R0603
  rect 0.806x0.864 smd: 1(-0.753,0) 2(0.753,0)
RES-ADJ-SMD_RM065-V1
  rect 2.2x2.1 hole 1: 1(-2.5,-2.5)
  round 2.2 hole 1: 2(0,2.5) 3(2.5,-2.5)
SMA_L4.3-W2.6-LS5.2-RD
  rect 2x2 smd: 1(-2.2,0) 2(2.2,0)
SOT-23-6_L2.9-W1.6-P0.95-LS2.8-BL
  rect 0.532x1.072 smd: 1(-0.95,-1.149) 2(0,-1.149) 3(0.95,-1.149) 4(0.95,1.149) 5(0,1.149) 6(-0.95,1.149)

## Nets
As in the schematic.

Pads without a net: U1 6

## Via types
v1: diameter 0.61, hole 0.305, Top Layer to Bottom Layer, 7 vias

## Routing (per net, layer and track width the routed paths; a pad name or vN(x,y) marks a point on that pad's centre or on a via; arc(x,y) is an arc through that point)
GND: length 149
  Top Layer w0.254: 26.2,8.68 26.2,3.78 ; 26.2,8.68 CN1.2 ; 26.2,8.68 28.14,10.62 28.14,20.82 ; 26.2,3.78 26.2,3.24 26.06,3.1 25.93,3.1 25.93,1.83 26.06,1.83 26.2,1.69 C1.2 ; 26.2,3.78 47.43,3.78 47.88,3.33 48.01,3.33 48.01,2.06 47.88,2.06 47.74,1.93 C2.2 ; R1.1 20.06,51.04 7.68,51.04 1.91,45.27 1.91,24.44 5.52,20.82 28.14,20.82 ; 28.14,20.82 U1.2
VCC: length 99.5
  Top Layer w0.254: 18.46,28.15 27.79,28.15 33.15,22.79 33.15,21.14 32.83,20.82 U1.5 U1.4 ; 18.46,28.15 6.32,40.29 L1.1 ; 18.46,28.15 13.33,28.15 v1(10.15,24.96) ; v1(3.09,3.68) 1.99,4.78 v1(1.99,7.27) ; v1(26.57,2.47) 27.6,1.43 C1.1
  Bottom Layer w0.254: v1(10.15,24.96) 1.99,16.8 v1(1.99,7.27) ; v1(26.57,2.47) 25.35,3.68 CN1.1 v1(3.09,3.68)
$1N430: length 76.9
  Top Layer w0.254: D1.2 42.24,5.95 30.16,18.03 30.16,21.45 29.84,21.77 U1.1 8.76,21.77 5.83,24.71 L1.2
$1N432: length 140.5
  Top Layer w0.254: 71.98,30.66 71.98,6.63 69.1,3.75 57.87,3.75 56.14,5.49 39.65,5.49 29.01,16.13 U1.3 ; 71.98,30.66 62.06,40.58 R1.2 ; 71.98,30.66 U2.1
$1N433: length 91.7
  Top Layer w0.254: v1(48.27,4.64) 55,4.64 58.08,1.55 D1.1 ; C2.1 46.34,1.66 v1(47.38,2.7) ; U2.2 50.56,28.16 U2.3 41.47,30.66 v1(40.98,30.17)
  Bottom Layer w0.254: v1(47.38,2.7) 53.06,8.38 U2.2 ; v1(48.27,4.64) 48.27,22.88 v1(40.98,30.17)

# Board MT3608V2
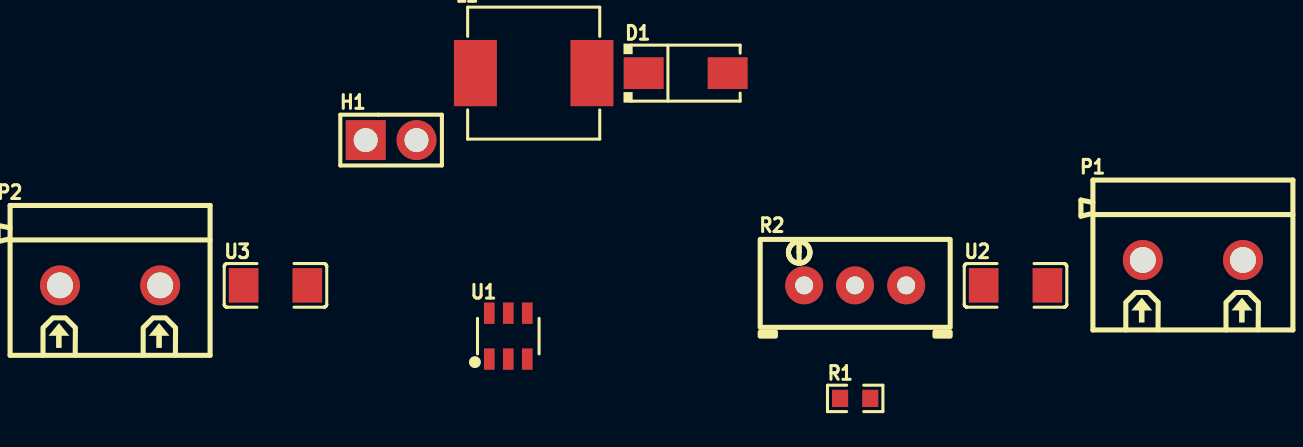
[diagram p7: board, top side]
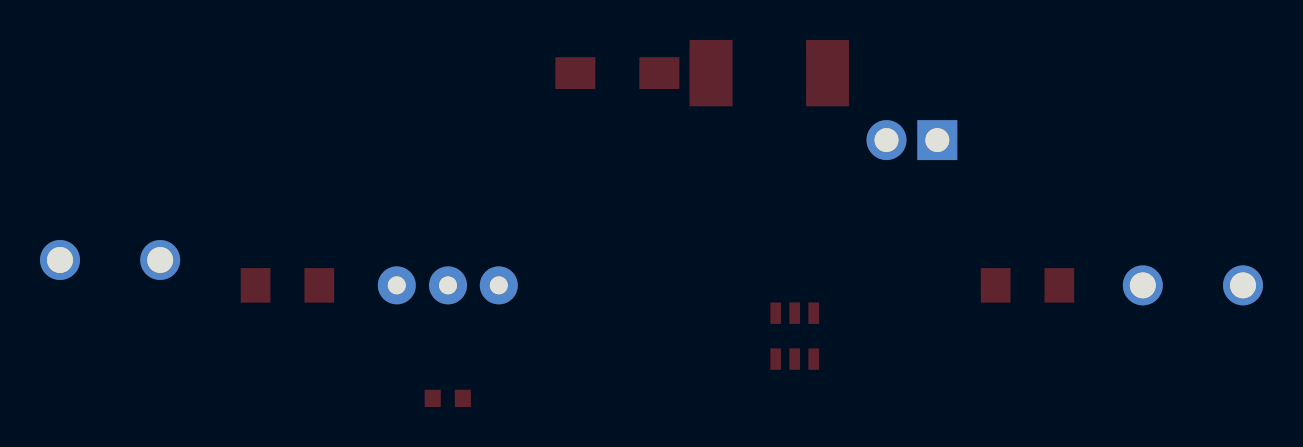
[diagram p8: board, bottom side, seen from below]

No outline. copper layers: Top Layer, Bottom Layer. Coordinates in mm from the lowest, leftmost part position.
Stack: Top Layer 0.035mm / Dielectric1 1.51mm FR4 er 4.5 / Bottom Layer 0.035mm

## Design rules (mm)
template: JLCPCB Capability(Two Layers Board)
spacing copperThickness1oz (default): track to track 0.102, other pairs 0.152 to 0.3
spacing copperThickness2oz: track to track 0.203, other pairs 0.152 to 0.3
track width copperThickness1oz (default): min 0.127, default 0.254, max 2.54
track width copperThickness2oz: min 0.203, default 0.254, max 2.54
differential pair differentialPair (default): width min 0.127, default 0.254, max 2.54; gap min 0.152, default 0.152
via viaSize (default): diameter min 0.5, default 0.61, max 10; hole min 0.3, default 0.305, max 6.3

## Placement (name value [footprint] x y rotation side)
D1  SS34  [SMA_L4.3-W2.5-LS5.0-RD]  28.78 16.28 0 top
H1  PZ254V-11-02P  [HDR-TH_2P-P2.54-V-M]  14.05 12.93 0 top
L1  22uH  [IND-SMD_L7.1-W6.6]  21.18 16.28 0 top
P1  WJ301V-5.0-2P  [CONN-TH_2P-P5.00_WJ301V-5.00-2P]  54.14 6.93 0 top
P2  WJ301V-5.0-2P  [CONN-TH_2P-P5.00_WJ301V-5.00-2P]  0 5.66 0 top
R1  2kΩ  [R0603]  37.25 0 0 top
R2  100kΩ  [RES-ADJ-TH_3P-L9.5-W4.9-P2.50-L_3296W]  37.25 5.66 0 top
U1  MT3608  [SOT-23-6_L2.9-W1.6-P0.95-LS2.8-BL]  19.91 3.12 0 top
U2  15uF  [C1206]  45.27 5.66 0 top
U3  15uF  [C1206]  8.27 5.66 0 top

## Footprints (pads in the part's own frame, mm; a bottom-side part is the same pattern mirrored in y, then rotated)
C1206
  rect 1.485x1.728 smd: 1(-1.593,0) 2(1.593,0)
CONN-TH_2P-P5.00_WJ301V-5.00-2P
  round 2 hole 1.3: 1(-2.505,0) 2(2.505,0)
HDR-TH_2P-P2.54-V-M
  rect 2x2 hole 1.2: 1(-1.27,0)
  round 2 hole 1.2: 2(1.27,0)
IND-SMD_L7.1-W6.6
  rect 2.15x3.32 smd: 1(-2.913,0) 2(2.913,0)
R0603
  rect 0.806x0.864 smd: 1(-0.753,0) 2(0.753,0)
RES-ADJ-TH_3P-L9.5-W4.9-P2.50-L_3296W
  round 1.9 hole 0.9: 1(-2.55,0) 2(-0.01,0) 3(2.55,0)
SMA_L4.3-W2.5-LS5.0-RD
  rect 2x1.593 smd: 1(-2.1,0) 2(2.1,0)
SOT-23-6_L2.9-W1.6-P0.95-LS2.8-BL
  rect 0.532x1.072 smd: 1(-0.95,-1.149) 2(0,-1.149) 3(0.95,-1.149) 4(0.95,1.149) 5(0,1.149) 6(-0.95,1.149)

## Nets
As in the schematic.

Pads without a net: U1 6
